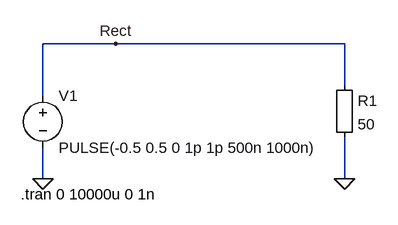
[diagram p0: schematic FourierReiheRectangular.asc]
FourierReiheRectangular.asc, the LTspice schematic file:
Version 4
SHEET 1 880 680
WIRE 160 64 48 64
WIRE 512 64 160 64
WIRE 512 128 512 64
WIRE 48 144 48 64
WIRE 48 272 48 224
WIRE 512 272 512 208
FLAG 48 272 0
FLAG 160 64 Rect
FLAG 512 272 0
SYMBOL voltage 48 128 R0
WINDOW 123 0 0 Left 2
WINDOW 39 0 0 Left 2
SYMATTR InstName V1
SYMATTR Value PULSE(-0.5 0.5 0 1p 1p 500n 1000n)
SYMBOL Misc\\EuropeanResistor 496 112 R0
SYMATTR InstName R1
SYMATTR Value 50
TEXT 14 296 Left 2 !.tran 0 10000u 0 1n

The netlist it stands for:
* FourierReiheRectangular.asc
V1 Rect 0 PULSE(-0.5 0.5 0 1p 1p 500n 1000n)
R1 Rect 0 50
.tran 0 10000u 0 1n
.backanno
.end

* Results of the author's LTspice run, read from the files saved beside the schematic
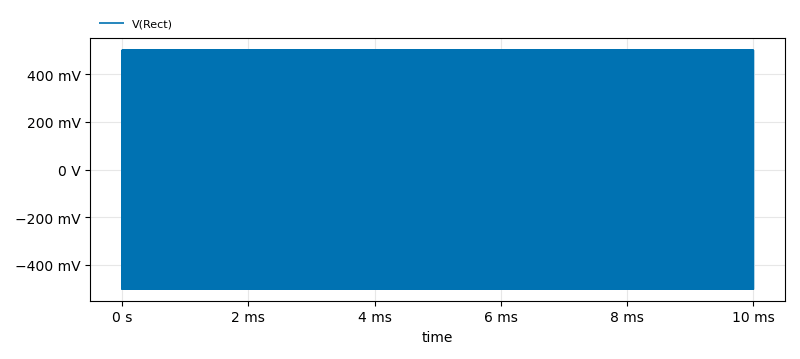
[diagram p1: Transient Analysis of FourierReiheRectangular.asc, plotted from the saved traces]
* Transient Analysis, 1 run:
*   V(Rect): min -500 mV, max 500 mV, average 1.011 µV, rms 500 mV, last -500 mV